# Altium schematic sheet Buzzer.SchDoc: Buzzer.
size 297 x 209 mm; Author: Dmitry Shpakov; Organization: NoName; Revision: Revision; SheetNumber: 9; SheetTotal: 11; PageSize: A4; ProjectName: Project Name
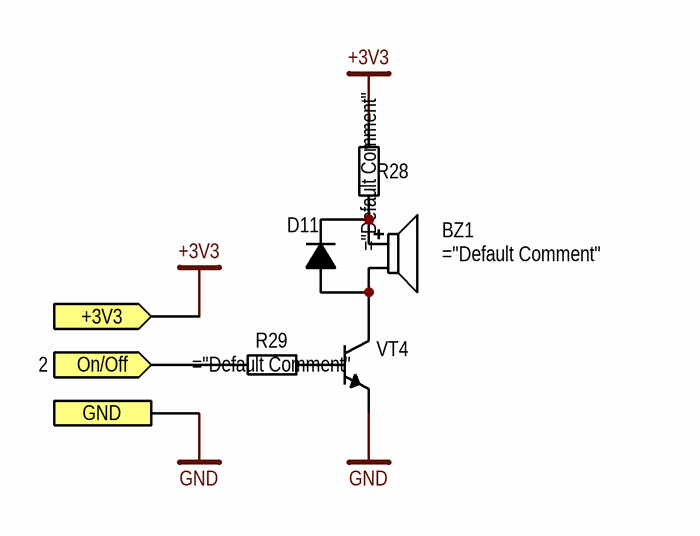
[diagram p0: Buzzer.SchDoc]

## Parts
BZ1  (no value)
D11  (no value)
R28  (no value)
R29  (no value)
VT4  (no value)

## Ports
+3V3 (in, see 2, 3, 6, 8), GND (see 2, 3, 4, 5, 6, 7, 8, 10, 11), On/Off (in, see 2)

## Nets
+3V3: R28.2 ; port +3V3
GND: VT4.E ; port GND
On/Off: R29.1 ; port On/Off
NetBZ1_NEG: BZ1.NEG D11.A VT4.C
NetBZ1_POS: BZ1.POS D11.C R28.1
NetR29_2: R29.2 VT4.B

## Notes on the sheet
- Author
- Date
- Organization
- Page
- Total pages
- Materials
- Page size

## Library data of the parts
BZ1 = SMT-0540-S-R: BUZZER MAGNETIC 3V 5X5MM SMD; Manufacturer: PUI Audio, Inc.; Power Dissipation: * W; Rated Current: 100 mA; Tolerance: * %; Other: Buzzers Transducer, Externally Driven Electromechanical/Magnetic 3 V 100mA 4kHz 78dB @ 3V, 10cm Surface Mount Solder Pads; Operating Temperature: -30 °C to +70 °C; Type: buzzer; HelpURL: https://www.digikey.com/en/products/detail/pui-audio-inc/SMT-0540-S-R/1464799; Default Comment: SMT-0540-S-R; Rated Voltage: 3 V; Rated Power: * W; Value: *; Summary: ="Type"+" "+"Part Number"+" "+"Manufacturer"+" "+"Value"+" "+"Tolerance"+" "+"Operating Temperature"+" "+"Case"+" "+"Power Dissipation"+" "+"Rated Current"+" "+"Rated Power"+" "+"Rated Voltage"+" "+"Other"; Assembly: *; Case: 5.0mm x 5.0mm; Part Number: SMT-0540-S-R
D11 = 1N4148WX-TP: DIODE GEN PURP 75V 150MA SOD323; Manufacturer: Micro Commercial Co; Power Dissipation: * W; Rated Current: 150 A; Tolerance: * %; Other: Diode 75 V 150mA Surface Mount SOD-323; Operating Temperature: -55 °C to +150 °C; Type: diode; HelpURL: https://www.digikey.com/en/products/detail/micro-commercial-co/1N4148WX-TP/717197; Default Comment: 1N4148WX-TP; Rated Voltage: 75 V; Rated Power: * W; Value: *; Summary: ="Type"+" "+"Part Number"+" "+"Manufacturer"+" "+"Value"+" "+"Tolerance"+" "+"Operating Temperature"+" "+"Case"+" "+"Power Dissipation"+" "+"Rated Current"+" "+"Rated Power"+" "+"Rated Voltage"+" "+"Other"; Assembly: *; Case: SOD-323; Part Number: 1N4148WX-TP
R28 = RC0603FR-0722RL: RES 22 OHM 1% 1/10W 0603; Manufacturer: YAGEO; Default Comment: 22R; Rated Voltage: * V; Rated Current: * A; Value: 22R; Other: 22 Ohms ±1% 0.1W, 1/10W Chip Resistor 0603 (1608 Metric) Moisture Resistant Thick Film; Operating Temperature: -55 °C to +155 °C; Type: resistor; HelpURL: https://www.digikey.com/en/products/detail/yageo/RC0603FR-0722RL/727055; Power Dissipation: 1/10 W; Rated Power: 1/10 W; Tolerance: 1 %; Summary: ="Type"+" "+"Part Number"+" "+"Manufacturer"+" "+"Value"+" "+"Tolerance"+" "+"Operating Temperature"+" "+"Case"+" "+"Power Dissipation"+" "+"Rated Current"+" "+"Rated Power"+" "+"Rated Voltage"+" "+"Other"; Assembly: *; Case: 0603; Part Number: RC0603FR-0722RL
R29 = RC0603FR-071KL: RES 1K OHM 1% 1/10W 0603; Manufacturer: YAGEO; Rated Voltage: * V; Rated Current: * A; Other: 1 kOhms ±1% 0.1W, 1/10W Chip Resistor 0603 (1608 Metric) Moisture Resistant Thick Film; Operating Temperature: -55 °C to +155 °C; Type: resistor; HelpURL: https://www.digikey.com/en/products/detail/yageo/RC0603FR-071KL/726843; Default Comment: 1k; Power Dissipation: 1/10 W; Rated Power: 1/10 W; Tolerance: 1 %; Value: 1k; Summary: ="Type"+" "+"Part Number"+" "+"Manufacturer"+" "+"Value"+" "+"Tolerance"+" "+"Operating Temperature"+" "+"Case"+" "+"Power Dissipation"+" "+"Rated Current"+" "+"Rated Power"+" "+"Rated Voltage"+" "+"Other"; Assembly: *; Case: 0603; Part Number: RC0603FR-071KL
VT4 = MMBT2222A-TP: TRANS NPN 40V 0.6A SOT23; Manufacturer: Micro Commercial Co; Type: transistor; Power Dissipation: 350 mW; Rated Voltage: * V; Rated Current: 600 mA; Tolerance: * %; Other: Bipolar (BJT) Transistor NPN 40 V 600 mA 300MHz 350 mW Surface Mount SOT-23; Operating Temperature: -55 °C to +150 °C; HelpURL: https://www.digikey.com/en/products/detail/micro-commercial-co/MMBT2222A-TP/717279; Default Comment: MMBT2222A-TP; Rated Power: 350 mW; Value: npn; Summary: ="Type"+" "+"Part Number"+" "+"Manufacturer"+" "+"Value"+" "+"Tolerance"+" "+"Operating Temperature"+" "+"Case"+" "+"Power Dissipation"+" "+"Rated Current"+" "+"Rated Power"+" "+"Rated Voltage"+" "+"Other"; Assembly: *; Case: SOT-23; Part Number: MMBT2222A-TP